# Altium schematic sheet MMC_2_4_PSU.SchDoc
size A4
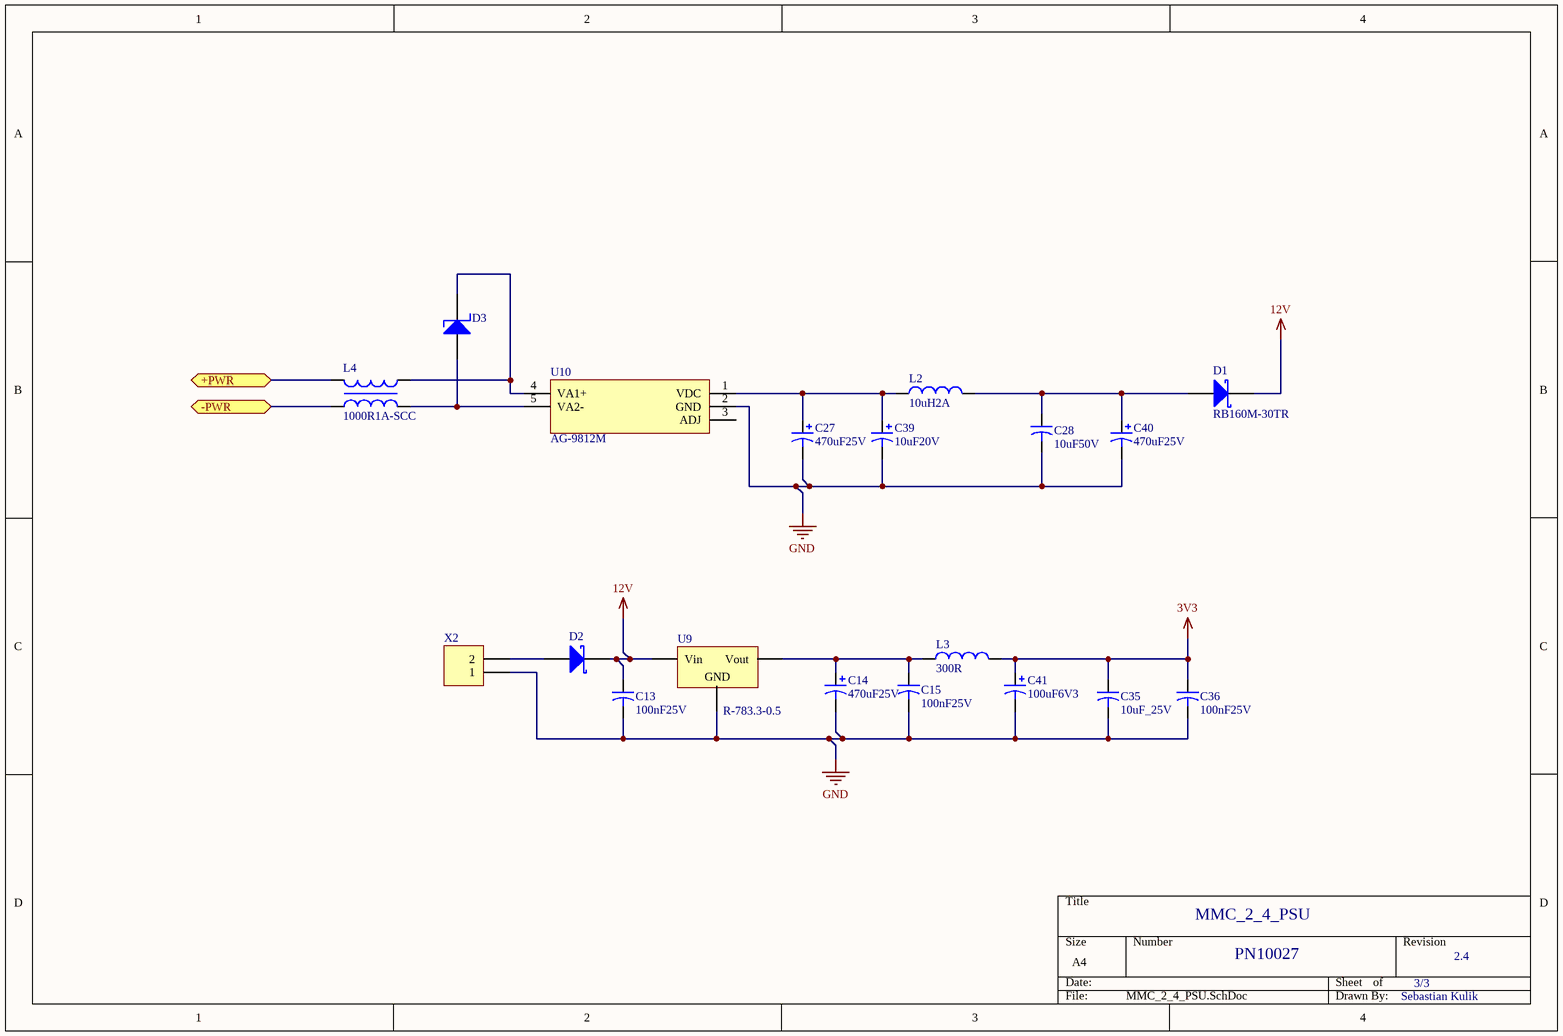
[diagram p0: MMC_2_4_PSU.SchDoc]

## Parts
C13  value 100nF25V  [C0402]  (hidden comment: 100nF25V_0402)
C14  value 470uF25V  [Panasonic-FT-F_Case]  (hidden comment: 470uF25V_POL_FT)
C15  value 100nF25V  [C0402]  (hidden comment: 100nF25V_0402)
C27  value 470uF25V  [Panasonic-FT-F_Case]  (hidden comment: 470uF25V_POL_FT)
C28  value 10uF50V  [C1210]  (hidden comment: 10uF50V_1210)
C35  value 10uF_25V  [C1210]  (hidden comment: 10uF25V_1210)
C36  value 100nF25V  [C0402]  (hidden comment: 100nF25V_0402)
C39  value 10uF20V  [Vishay293D-B]  (hidden comment: 10uF_20V_V293D-B)
C40  value 470uF25V  [Panasonic-FT-F_Case]  (hidden comment: 470uF25V_POL_FT)
C41  value 100uF6V3  [Vishay293D-B]  (hidden comment: 100uF_6V3_V293D-B)
D1  RB160M-30TR  [SOD123]
D2  RB160M-30TR  [SOD123]  (value not drawn)
D3  SMAJ58A-E3/61  [DO214A]  (value not drawn)
L2  10uH2A  [WE-PD2_1]
L3  value 300R  [L0603]  (hidden comment: 300R2A_0603)
L4  1000R1A-SCC  [WE-SCC_7345]
U9  R-783.3-0.5  [R-783_3-0_5]
U10  AG-9812M  [Ag9812M]
X2  WR-TBL3127  [WR-TBL-3127]  (value not drawn)

## Ports
+PWR, -PWR

## Nets
3V3: C35.1 C36.1 C41.1 L3.2
12V: C13.1 D1.1(K) D2.1(K) U9.1(Vin)
GND: C13.2 C14.2 C15.2 C27.2 C28.2 C35.2 C36.2 C39.2 C40.2 C41.2 U9.2(GND) U10.2(GND) X2.1
+PWR: L4.2 ; port +PWR
-PWR: L4.1 ; port -PWR
NetC14_1: C14.1 C15.1 L3.1 U9.3(Vout)
NetC27_1: C27.1 C39.1 L2.1 U10.1(VDC)
NetC28_1: C28.1 C40.1 D1.2(A) L2.2
NetD2_2: D2.2(A) X2.2
NetD3_1: D3.1(K) L4.4 U10.4(VA1+)
NetD3_2: D3.2(A) L4.3 U10.5(VA2-)

Not connected (* = marked no-connect by the designer): U10 3(ADJ)

## Notes on the sheet
- MMC_2_4_PSU
- PN10027
- 3/3
- 2.4
- Sebastian Kulik

## Library data of the parts
C13 C15 C36 = 100nF25V_0402: AVX, X5R, 10%, 25V; Deliverer PartNr: 1833862; Manufacturer PartNr: 04023D104KAT2A; Deliverer: Farnell; TDE-PN: C0036; Published: 09.12.2014; Part Description: AVX, X5R, 10%, 25V; Publisher: Sebastian Kulik; PackageDescription: C0402; Manufacturer: AVX
C14 C27 C40 = 470uF25V_POL_FT: Panasonic, FT series; Deliverer PartNr: 1868411; Manufacturer PartNr: EEEFT1E471AP; Deliverer: Farnell; TDE-PN: C0048; Published: 23.09.2014; Part Description: Panasonic, FT series; Publisher: Sebastian Kulik; PackageDescription: Panasonic-FT-F; Manufacturer: Panasonic
C28 = 10uF50V_1210: AVX,  X7R, 10%, 50V; Deliverer PartNr: 2094047RL; Manufacturer PartNr: 12105C106KAT2A; Deliverer: Farnell; TDE-PN: C0039; Published: 17.02.2014; Part Description: AVX,  X7R, 10%, 50V; Publisher: Sebastian Kulik; PackageDescription: C1210; Manufacturer: AVX
C35 = 10uF25V_1210: TDK  C series, X5R, 10%, 25V; Deliverer PartNr: 2346957; Manufacturer PartNr: C3225X5R1E106K250AA; Deliverer: Farnell; TDE-PN: C0014; Published: 12.02.2014; Part Description: TDK  C series, X5R, 10%, 25V; Publisher: Sebastian Kulik; PackageDescription: C1210; Manufacturer: TDK
C39 = 10uF_20V_V293D-B: 293 series, tantal, 10%, 10V; Part Description: 293 series, tantal, 10%, 20V; Deliverer PartNr: 1754203; Manufacturer: Vishay; Manufacturer PartNr: 293D106X9020B2TE3; Deliverer: Farnell; TDE-PN: C0043; Published: 14.03.2014; Publisher: Sebastian Kulik; PackageDescription: Vishay-293D-B
C41 = 100uF_6V3_V293D-B: 293 series, tantal, 10%, 6.3V; Deliverer PartNr: 1754153; Manufacturer: Vishay; Manufacturer PartNr: 293D107X96R3B2TE3; Deliverer: Farnell; TDE-PN: C0028; Published: 11.03.2014; Part Description: 293 series, tantal, 10%, 6.3V; Publisher: Sebastian Kulik; PackageDescription: Vishay293D-B
D1 D2 = RB160M-30TR: Diode Schottky,2A,40V; Deliverer PartNr: 1525480; Manufacturer: Rohm; TDE-PN: DIS0010; Deliverer: Farnell; Published: 17.02.2014; Publisher: Sebastian Kulik; PackageDescription: SOD123; Manufacturer PartNr: RB160M-30TR
D3 = SMAJ58A-E3/61: TVS, 400W, 58V; Deliverer PartNr: 1837053; Manufacturer: Vishay; TDE-PN: DIS0009; Deliverer: Farnell; Published: 17.02.2014; Publisher: Sebastian Kulik; PackageDescription: DO214AC; Manufacturer PartNr: SMAJ58A-E3/61
L2 = 10uH2A_WE-PD2: WE-PD2, 10uH2A; Deliverer PartNr: 74477510; Deliverer: WE; TDE-PN: P0017; Manufacturer: WE; Manufacturer PartNr: 74477510; Published: 17.02.2014; Publisher: Sebastian Kulik; Value: 10uH2A; PackageDescription: WE-PD2_1
L3 = 300R2A_0603: WE, Ferrit, 300Rx2A; Deliverer PartNr: 742792641; TDE-PN: P0021; Deliverer: WE; Manufacturer: WE; Manufacturer PartNr: 742792641; Published: 26.05.2014; Publisher: Sebastian Kulik; PackageDescription: L0603
L4 = 1000R1A-SCC: Common mode choke; Deliverer PartNr: 744281100; Deliverer: WE; TDE-PN: P0034; Manufacturer: WE; Manufacturer PartNr: 744281100; Published: 30.01.2015; Publisher: Sebastian Kulik; PackageDescription: WE-CMS; Value: 1000R1A-SCC
U9 = Recom-R-783_3-0_5: Voltage Regulator; Manufacturer: Recom; Deliverer PartNr: 532-8044; TDE-PN: IC0032; Deliverer: RS-Components; Published: 12.02.2014; Manufacturer PartNr: R-783.3-0.5; Publisher: Sebastian Kulik; PackageDescription: R-783_3-0_5/D-PACK
U10 = AG-9812M: PoE, 12V; Manufacturer: Silvertel; Deliverer: Codico; TDE-PN: IC0052; Published: 17.02.2014; Deliverer PartNr: AG-9812M; Publisher: Sebastian Kulik; Manufacturer PartNr: AG-9812M; PackageDescription: AG9812M
X2 = Header-2-WR-TBL3127: Header 2 pin, horizontal,WR-TBL3127; Deliverer PartNr: 1841288; Manufacturer: WE; Manufacturer PartNr: 691312710002; Deliverer: Farnell; TDE-PN: CON0014; LatestRevisionDate: 28.05.2014; LatestRevisionNote: Re-released for DXP Platform.; Publisher: Sebastian Kulik; PackageDescription: WR-TBL-3127